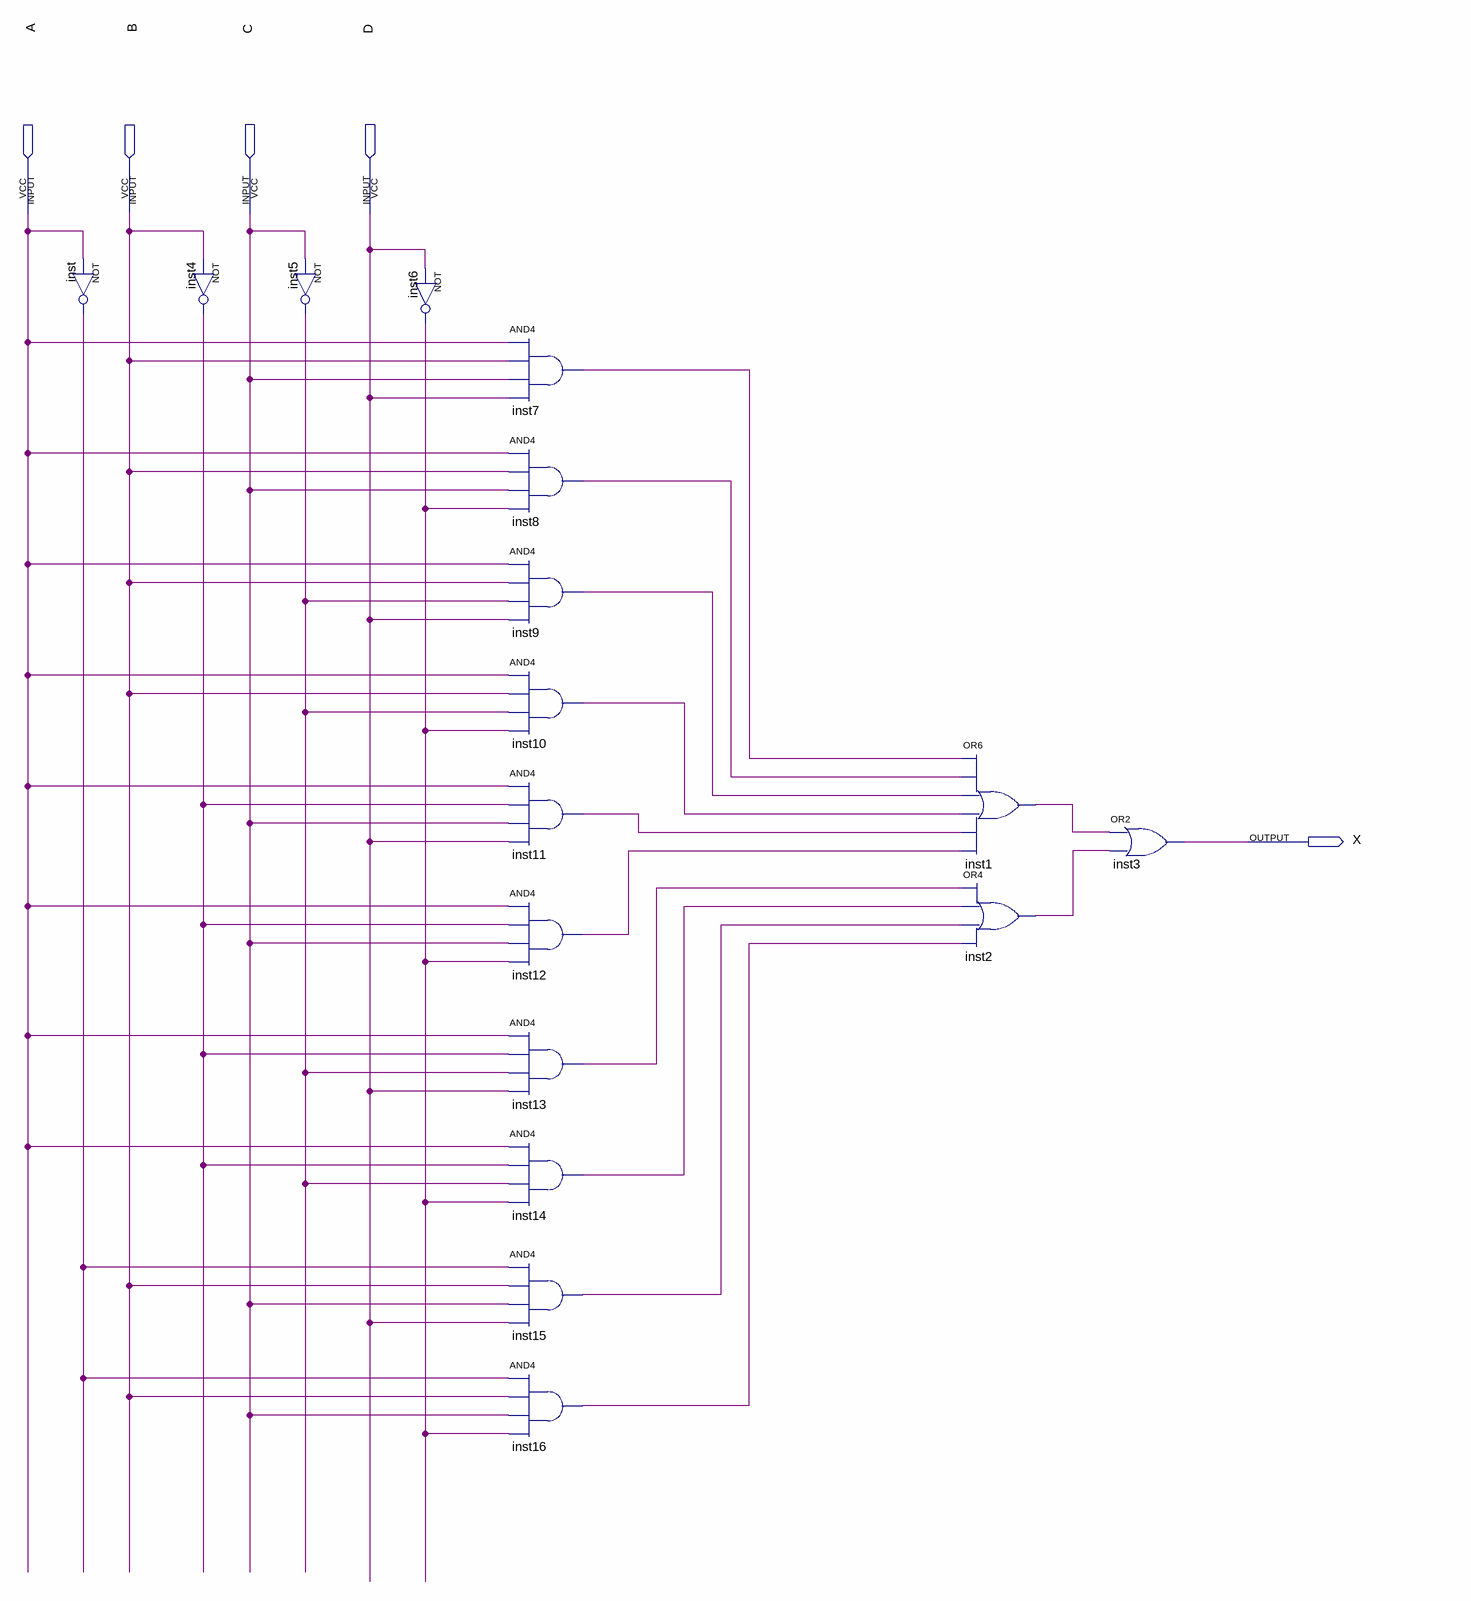
[diagram p0: schematic sheet]
// Quartus schematic lab2_1.bdf as structural Verilog: 17 symbols, 5 pins
module lab2_1 (
  input  A,
  input  B,
  input  C,
  input  D,
  output X
);

  wire inst1_out, inst2_out, inst4_out, inst5_out, inst6_out, inst7_out, inst8_out, inst9_out, inst10_out,
       inst11_out, inst12_out, inst13_out, inst14_out, inst15_out, inst16_out, inst_out;

  not inst (inst_out, A);
  not inst4 (inst4_out, B);
  not inst5 (inst5_out, C);
  not inst6 (inst6_out, D);
  and inst7 (inst7_out, A, B, C, D);
  and inst8 (inst8_out, A, B, C, inst6_out);
  and inst9 (inst9_out, A, B, inst5_out, D);
  and inst10 (inst10_out, A, B, inst5_out, inst6_out);
  and inst11 (inst11_out, A, inst4_out, C, D);
  and inst12 (inst12_out, A, inst4_out, C, inst6_out);
  and inst13 (inst13_out, A, inst4_out, inst5_out, D);
  and inst14 (inst14_out, A, inst4_out, inst5_out, inst6_out);
  and inst15 (inst15_out, inst_out, B, C, D);
  and inst16 (inst16_out, inst_out, B, C, inst6_out);
  or inst1 (inst1_out, inst7_out, inst8_out, inst9_out, inst10_out, inst11_out, inst12_out);
  or inst2 (inst2_out, inst13_out, inst14_out, inst15_out, inst16_out);
  or inst3 (X, inst1_out, inst2_out);
endmodule
